# Altium schematic sheet DIGITAL_INPUTS.SchDoc: Digital Inputs
size 420 x 297 mm; Author: G.Kasprowicz; DrawnBy: G.Kasprowicz; Organization: Altium Limited; Address1: L3, 12a Rodborough Rd; Address2: Frenchs Forest; Address3: NSW; Address4: Australia 2086; DocumentNumber: 14; SheetNumber: 14; SheetTotal: 37; ModifiedBy: -; CheckedDate: -; Title2: Fast Stabilizer; DivGrp: WUT ISE; Designer: G.Kasprowicz
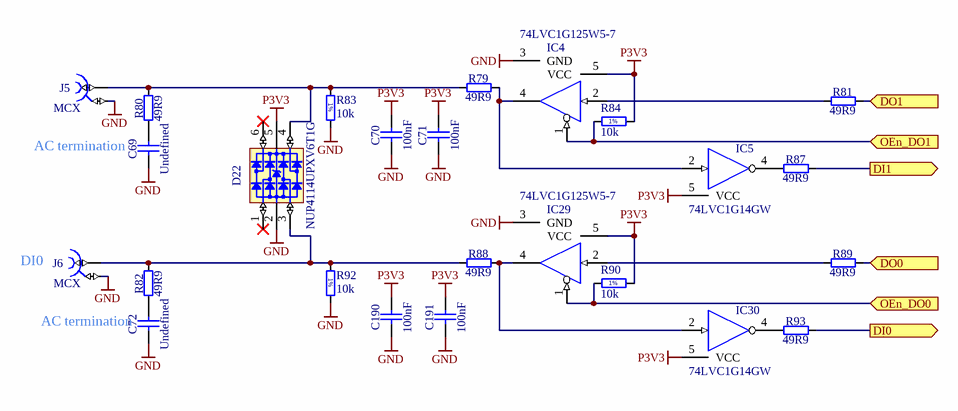
[diagram p0: DIGITAL_INPUTS.SchDoc]

## Parts
C69  Undefined  [CAPC1608X90N]
C70  100nF  [CAPC1005X55N]
C71  100nF  [CAPC1005X55N]
C72  Undefined  [CAPC1608X90N]
C190  100nF  [CAPC1005X55N]
C191  100nF  [CAPC1005X55N]
D22  NUP4114UPXV6T1G  [SOTFL50P160X60-6N]
IC4  74LVC1G125W5-7  [SOT95P280X145-5N]
IC5  74LVC1G14GW  [SOT65P212X110-5N]
IC29  74LVC1G125W5-7  [SOT95P280X145-5N]
IC30  74LVC1G14GW  [SOT65P212X110-5N]
J5  MCX  [AMPHENOL_919-383J-51A]
J6  MCX  [AMPHENOL_919-383J-51A]
R79  49R9  [RESC1005X40N]
R80  49R9  [RESC1005X40N]
R81  49R9  [RESC1005X40N]
R82  49R9  [RESC1005X40N]
R83  10k  [RESC1005X40N]
R84  10k  [RESC1005X40N]
R87  49R9  [RESC1005X40N]
R88  49R9  [RESC1005X40N]
R89  49R9  [RESC1005X40N]
R90  10k  [RESC1005X40N]
R92  10k  [RESC1005X40N]
R93  49R9  [RESC1005X40N]

## Ports
DI0 (out), DI1 (out), DO0 (in), DO1 (in), OEn_DO0 (in), OEn_DO1 (in)

## Nets
GND: C69.1 C70.1 C71.1 C72.1 C190.1 C191.1 D22.2(GND) IC4.3(GND) IC5.3(GND) IC29.3(GND) IC30.3(GND) J5.2 J6.2 R83.2 R92.2
P3V3: C70.2 C71.2 C190.2 C191.2 D22.5(VBUS) IC4.5(VCC) IC5.5(VCC) IC29.5(VCC) IC30.5(VCC) R84.2 R90.2
DI0: R93.2 ; port DI0
DI1: R87.2 ; port DI1
DO0: R89.2 ; port DO0
DO1: R81.2 ; port DO1
OEn_DO0: IC29.1(~{G}) R90.1 ; port OEn_DO0
OEn_DO1: IC4.1(~{G}) R84.1 ; port OEn_DO1
NetC69_2: C69.2 R80.1
NetC72_2: C72.2 R82.1
NetD22_3: D22.3(I/O2) J6.1 R82.2 R88.1 R92.1
NetD22_4: D22.4(I/O3) J5.1 R79.1 R80.2 R83.1
NetIC4_2: IC4.2(IN) R81.1
NetIC4_4: IC4.4(OUT) IC5.2(IN) R79.2
NetIC5_4: IC5.4(OUT) R87.1
NetIC29_2: IC29.2(IN) R89.1
NetIC29_4: IC29.4(OUT) IC30.2(IN) R88.2
NetIC30_4: IC30.4(OUT) R93.1

Not connected (* = marked no-connect by the designer): D22 1(I/O1)* 6(I/O4)*

## Notes on the sheet
- AC termination
- (near J6) DI0
- (near C72) AC termination
- Project/Equipment
- Document
- Designer
- Drawn by
- Check.by
- Copyright WUT ISE 2020.
  This documentation describes Open Hardware and is licensed under the CERN OHL v.1.2. You may redistribute and modify this documentation under the terms of the CERN OHL v.1.2. (http://ohwr.org/CERNOHL). This documentation is distributed WITHOUT ANY EXPRESS OR IMPLIED WARRANTY, INCLUDING OF MERCHANTABILITY, SATISFACTORY QUALITY AND FITNESS FOR A PARTICULAR PURPOSE. Please see the CERN OHL v.1.2 for applicable conditions.
- Contact
- File
- Last Mod.
- Print Date
- Sheet
- Size
- A3
- of
- Rev
- (in symbol R0402_10K_1%_0.0625W_100PPM) 1%

## Library data of the parts
C69 C72 = CC0603_NO-VALUE: Non-polarised capacitor; Part Description: Reserved Footprint For 0603(1608) Chip Ceramic Capacitor; Mounted: No; Part Number: CC0603_NO-VALUE; Component Kind: Standard; Component Type: Standard; Pin Count: 2; Value: Undefined; Status: None; Manufacturer: Undefined; Manufacturer Part Number: CC0603_NO-VALUE; Case: 0603; Socket: No; SMD: Yes; Sense: No; Manufacturer1 ComponentHeight: 0.9mm; HelpURL: Undefined; Author: CERN DEM MR; CreateDate: 22.11.2016; LatestRevisionDate: 22.11.2016
C70 C71 C190 C191 = CC0402_100NF_16V_10%_X7R: Non-polarised capacitor; Part Description: SMD Multilayer Chip Ceramic Capacitor; Manufacturer: GENERIC; Manufacturer1 Part Number: GRM155R71C104KA88D; Voltage: 16V; TC: X7R; Tolerance: ±10%; Part Number: CC0402_100NF_16V_10%_X7R; Component Kind: Standard; Component Type: Standard; Pin Count: 2; Value: 100nF; Status: Not Recommended; Manufacturer Part Number: CC0402_100NF_16V_10%_X7R; Case: 0402; Mounted: Yes; Socket: No; SMD: Yes; Sense: No; Manufacturer1 Example: MURATA; Manufacturer1 ComponentHeight: 0.55mm; HelpURL: \\cern.ch\dfs\Applications\Altium\Datasheets\CC0402_X7R_MURATA_GRM.pdf; Author: CERN DEM JLC; CreateDate: 05.12.2013; LatestRevisionDate: 03.12.2007
D22 = NUP4114UPXV6T1G: Part Description: ESD Protection Diodes Array (8kV) with Low Clamping Voltage; Manufacturer: ON SEMICONDUCTOR; Voltage: 5.5V; PressFit: No; Bonding: No; Part Number: NUP4114UPXV6T1G; Component Kind: Standard; Component Type: Standard; Device: NUP4114UPXV6T1G; PackageDescription: SOTFL (SOT666, SOT563,), 0.50mm, Pitch; 6 Pin, 1.20mm W X 1.60mm L X 0.60mm H Body, IPC Medium Density; Manufacturer Part Number: NUP4114UPXV6T1G; Pin Count: 8; Mounted: Yes; Socket: No; SMD: Yes; Sense: No; ComponentHeight: 1.75mm; HelpURL: \\cern.ch\dfs\Applications\Altium\Datasheets\NUP4114UPXV6T1G.pdf; Author: CERN DEM JLC; CreateDate: 05.12.2012; LatestRevisionDate: 05.12.2012
IC4 IC29 = 74LVC1G125W5-7: Single Bus Buffer Gate With 3-State Output; Manufacturer: DIODES; PressFit: No; Bonding: No; Part Number: 74LVC1G125W5-7; Component Kind: Standard; Component Type: Standard; Device: 74LVC1G125W5-7; PackageDescription: SOT, 0.95mm Pitch; 5 Pin, 1.60mm W X 2.90mm L X 1.45mm H body, IPC Medium Density; Part Description: Single Bus Buffer Gate With 3-State Output; Manufacturer Part Number: 74LVC1G125W5-7; Pin Count: 5; Case: SOT23-5; Mounted: Yes; Socket: No; SMD: Yes; Sense: No; ComponentHeight: 1.45mm; Author: GK; HelpURL: \\cern.ch\dfs\Applications\Altium\Datasheets\SN74AHC1G125DBV.pdf; CreateDate: 18.05.2016; LatestRevisionDate: 18.05.2016
IC5 IC30 = 74LVC1G14GW: Single Schmitt-Trigger Inverter; Manufacturer: NXP SEMICONDUCTORS; PressFit: No; Bonding: No; Part Number: 74LVC1G14GW; Component Kind: Standard; Component Type: Standard; Device: 74LVC1G14GW; PackageDescription: SOT353, SC70-5, 0.65mm Pitch; 5 Pin, 1.25mm W X 2.05mm L X 1.10mm H body, IPC Medium Density; Part Description: Single Schmitt-trigger inverter; Manufacturer Part Number: 74LVC1G14GW; Pin Count: 4; Case: SOT353; Mounted: Yes; Socket: No; SMD: Yes; Sense: No; ComponentHeight: 1.1mm; Author: CERN DEM JLC; HelpURL: \\cern.ch\dfs\Applications\Altium\Datasheets\74LVC1G14GW.pdf; CreateDate: 04.07.2012; LatestRevisionDate: 04.07.2012
J5 J6 = AMPHENOL_919-383J-51A: Part Description: 50 Ohm, RF Connector, MCX Right Angle PCB Receptacle Jack; PressFit: No; Part Number: AMPHENOL_919-383J-51A; Component Kind: Standard; Component Type: Standard; Pin Count: 5; Family: MCX; Mounted: Yes; Socket: No; SMD: No; Sense: No; Status: None; Manufacturer: AMPHENOL; Manufacturer Part Number: 919-383J-51A; ComponentHeight: 6mm; HelpURL: \\cern.ch\dfs\Applications\Altium\Datasheets\AMPHENOL_919-383J-51A.pdf; Author: CERN DEM BC; CreateDate: 31.01.2019; LatestRevisionDate: 31.01.2019
R79-R82 R87-R89 R93 = R0402_49R9_1%_0.0625W_100PPM: Resistor - 1%; Part Description: General Purpose Thick Film Chip Resistor; Manufacturer: GENERIC; Manufacturer1 Part Number: 232270674999L or RC0402FR-0749R9L; TC: ±100ppm/°C; PressFit: No; Part Number: R0402_49R9_1%_0.0625W_100PPM; Component Kind: Standard; Component Type: Standard; Pin Count: 2; Value: 49R9; Status: Not Recommended; Power: 0.0625W; Tolerance: ±1%; Manufacturer Part Number: R0402_49R9_1%_0.0625W_100PPM; Case: 0402; Mounted: Yes; Sense: No; Socket: No; SMD: Yes; Manufacturer1 Example: YAGEO PHYCOMP; Manufacturer1 ComponentHeight: 0.4mm; HelpURL: \\cern.ch\dfs\Applications\Altium\Datasheets\R0402_Phycomp_RC0402.pdf; Author: CERN DEM JLC; CreateDate: 24.10.2012; LatestRevisionDate: 24.10.2012
R83 R84 R90 R92 = R0402_10K_1%_0.0625W_100PPM: Resistor - 1%; Part Description: General Purpose Thick Film Chip Resistor; Manufacturer: GENERIC; Manufacturer1 Part Number: 232270671003L; TC: ±100ppm/°C; Part Number: R0402_10K_1%_0.0625W_100PPM; Component Kind: Standard; Component Type: Standard; Pin Count: 2; Value: 10k; Status: Not recommended; Power: 0.0625W; Tolerance: ±1%; Manufacturer Part Number: R0402_10K_1%_0.0625W_100PPM; Case: 0402; Mounted: Yes; Sense: No; Socket: No; SMD: Yes; Manufacturer1 Example: YAGEO PHYCOMP; Manufacturer1 ComponentHeight: 0.4mm; HelpURL: \\cern.ch\dfs\Applications\Altium\Datasheets\R0402_Phycomp_RC0402.pdf; Author: CERN DEM JLC; CreateDate: 03.12.2007; LatestRevisionDate: 17.10.2012